# Altium schematic sheet SD Card.SchDoc
size A; SheetNumber: 7; SheetTotal: 7
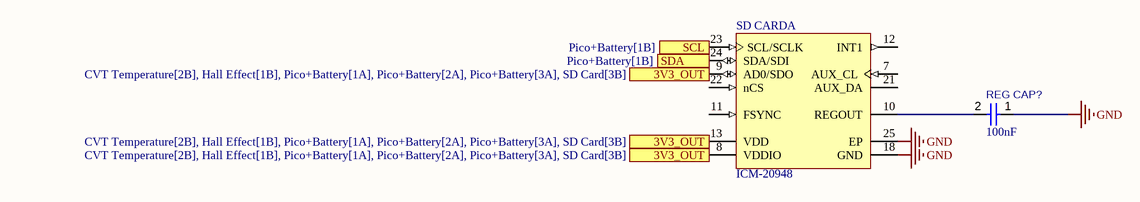
[diagram p0: SD Card.SchDoc]

## Parts
REG_CAP?  value 100nF  (hidden comment: Small-Transient Cap - GMK107B7104KAHT)
SD_CARD  ICM-20948  [TDK-QFN-24_L]  (part A of 2)

## Ports
3V3_OUT (see CVT Temperature[2B], Hall Effect[1B], Pico+Battery[1A], Pico+Battery[2A], Pico+Battery[3A], SD Card[3B]), SCL (see Pico+Battery[1B]), SDA (see Pico+Battery[1B])

## Nets
GND: REG_CAP?.1 SD_CARD.18(GND) SD_CARD.25(EP)
3V3_OUT: SD_CARD.8(VDDIO) SD_CARD.9(AD0/SDO) SD_CARD.13(VDD) ; port 3V3_OUT
SCL: SD_CARD.23(SCL/SCLK) ; port SCL
SDA: SD_CARD.24(SDA/SDI) ; port SDA
NetREG_CAP?_2: REG_CAP?.2 SD_CARD.10(REGOUT)

Not connected (* = marked no-connect by the designer): SD_CARD 7(AUX_CL) 11(FSYNC) 12(INT1) 21(AUX_DA) 22(nCS)

## Library data of the parts
REG_CAP? = CMP-001-00086-1: Multilayer Ceramic Capacitors MLCC - SMD/SMT .1uF 35Volts X7R +/-10% 0603 STD; Tolerance: 10%; Voltage Rating (DC): 35V; Case Code (Metric): 1608; Ratings: AEC-Q200; Width: 800µm; Length: 1.6mm; Case Code (Imperial): 0603; Max Width: 900µm; Min Width: 700µm; Min Operating Temperature: -55°C; Lifecycle Status: Production; Thickness: 889µm; Case/Package: 0603; Lead Free: Lead Free; Min Thickness: 700µm; Number of Terminals: 2; Material: Ceramic; Halogen Free: Halogen Free; Termination: SMD/SMT; Max Length: 1.7mm; Max Thickness: 900µm; Packaging: Cut Tape (CT); Max Operating Temperature: 125°C; Voltage Rating: 35V; Dielectric: X7R; RoHS: Compliant; Mounting Technology: Surface Mount; REACH SVHC: Yes; Min Length: 1.5mm; Height: 800µm; Dielectric Material: Ceramic
SD_CARD = CMP-2000-07532-1: World’s Lowest Power 9-Axis MEMS MotionTracking(TM) Device, 1.71 to 3.6 V, -40 to 85 degC, 24-Pin QFN, RoHS, Tape and Reel; Manufacturer: TDK; Package Description: 24-Pin Quad Flat No-lead Package, Body 3 x 3 mm, Pitch 0.4 mm; Datasheet Version: Rev. 1.3, 06/2017; Package Reference: QFN-24; Mounting Technology: SurfaceMount; Datasheet URL: https://www.invensense.com/wp-content/uploads/2016/06/DS-000189-ICM-20948-v1.3.pdf; Manufacturer URL: http://www.tdk.com/